# EasyEDA schematic SCH_test2_2024-01-14.json
TITLE: Sheet_1; REV: 1.0; Date: 2024-01-11; Sheet: 1/1; Drawn By: Dominic Cangemi; Company: Your Company
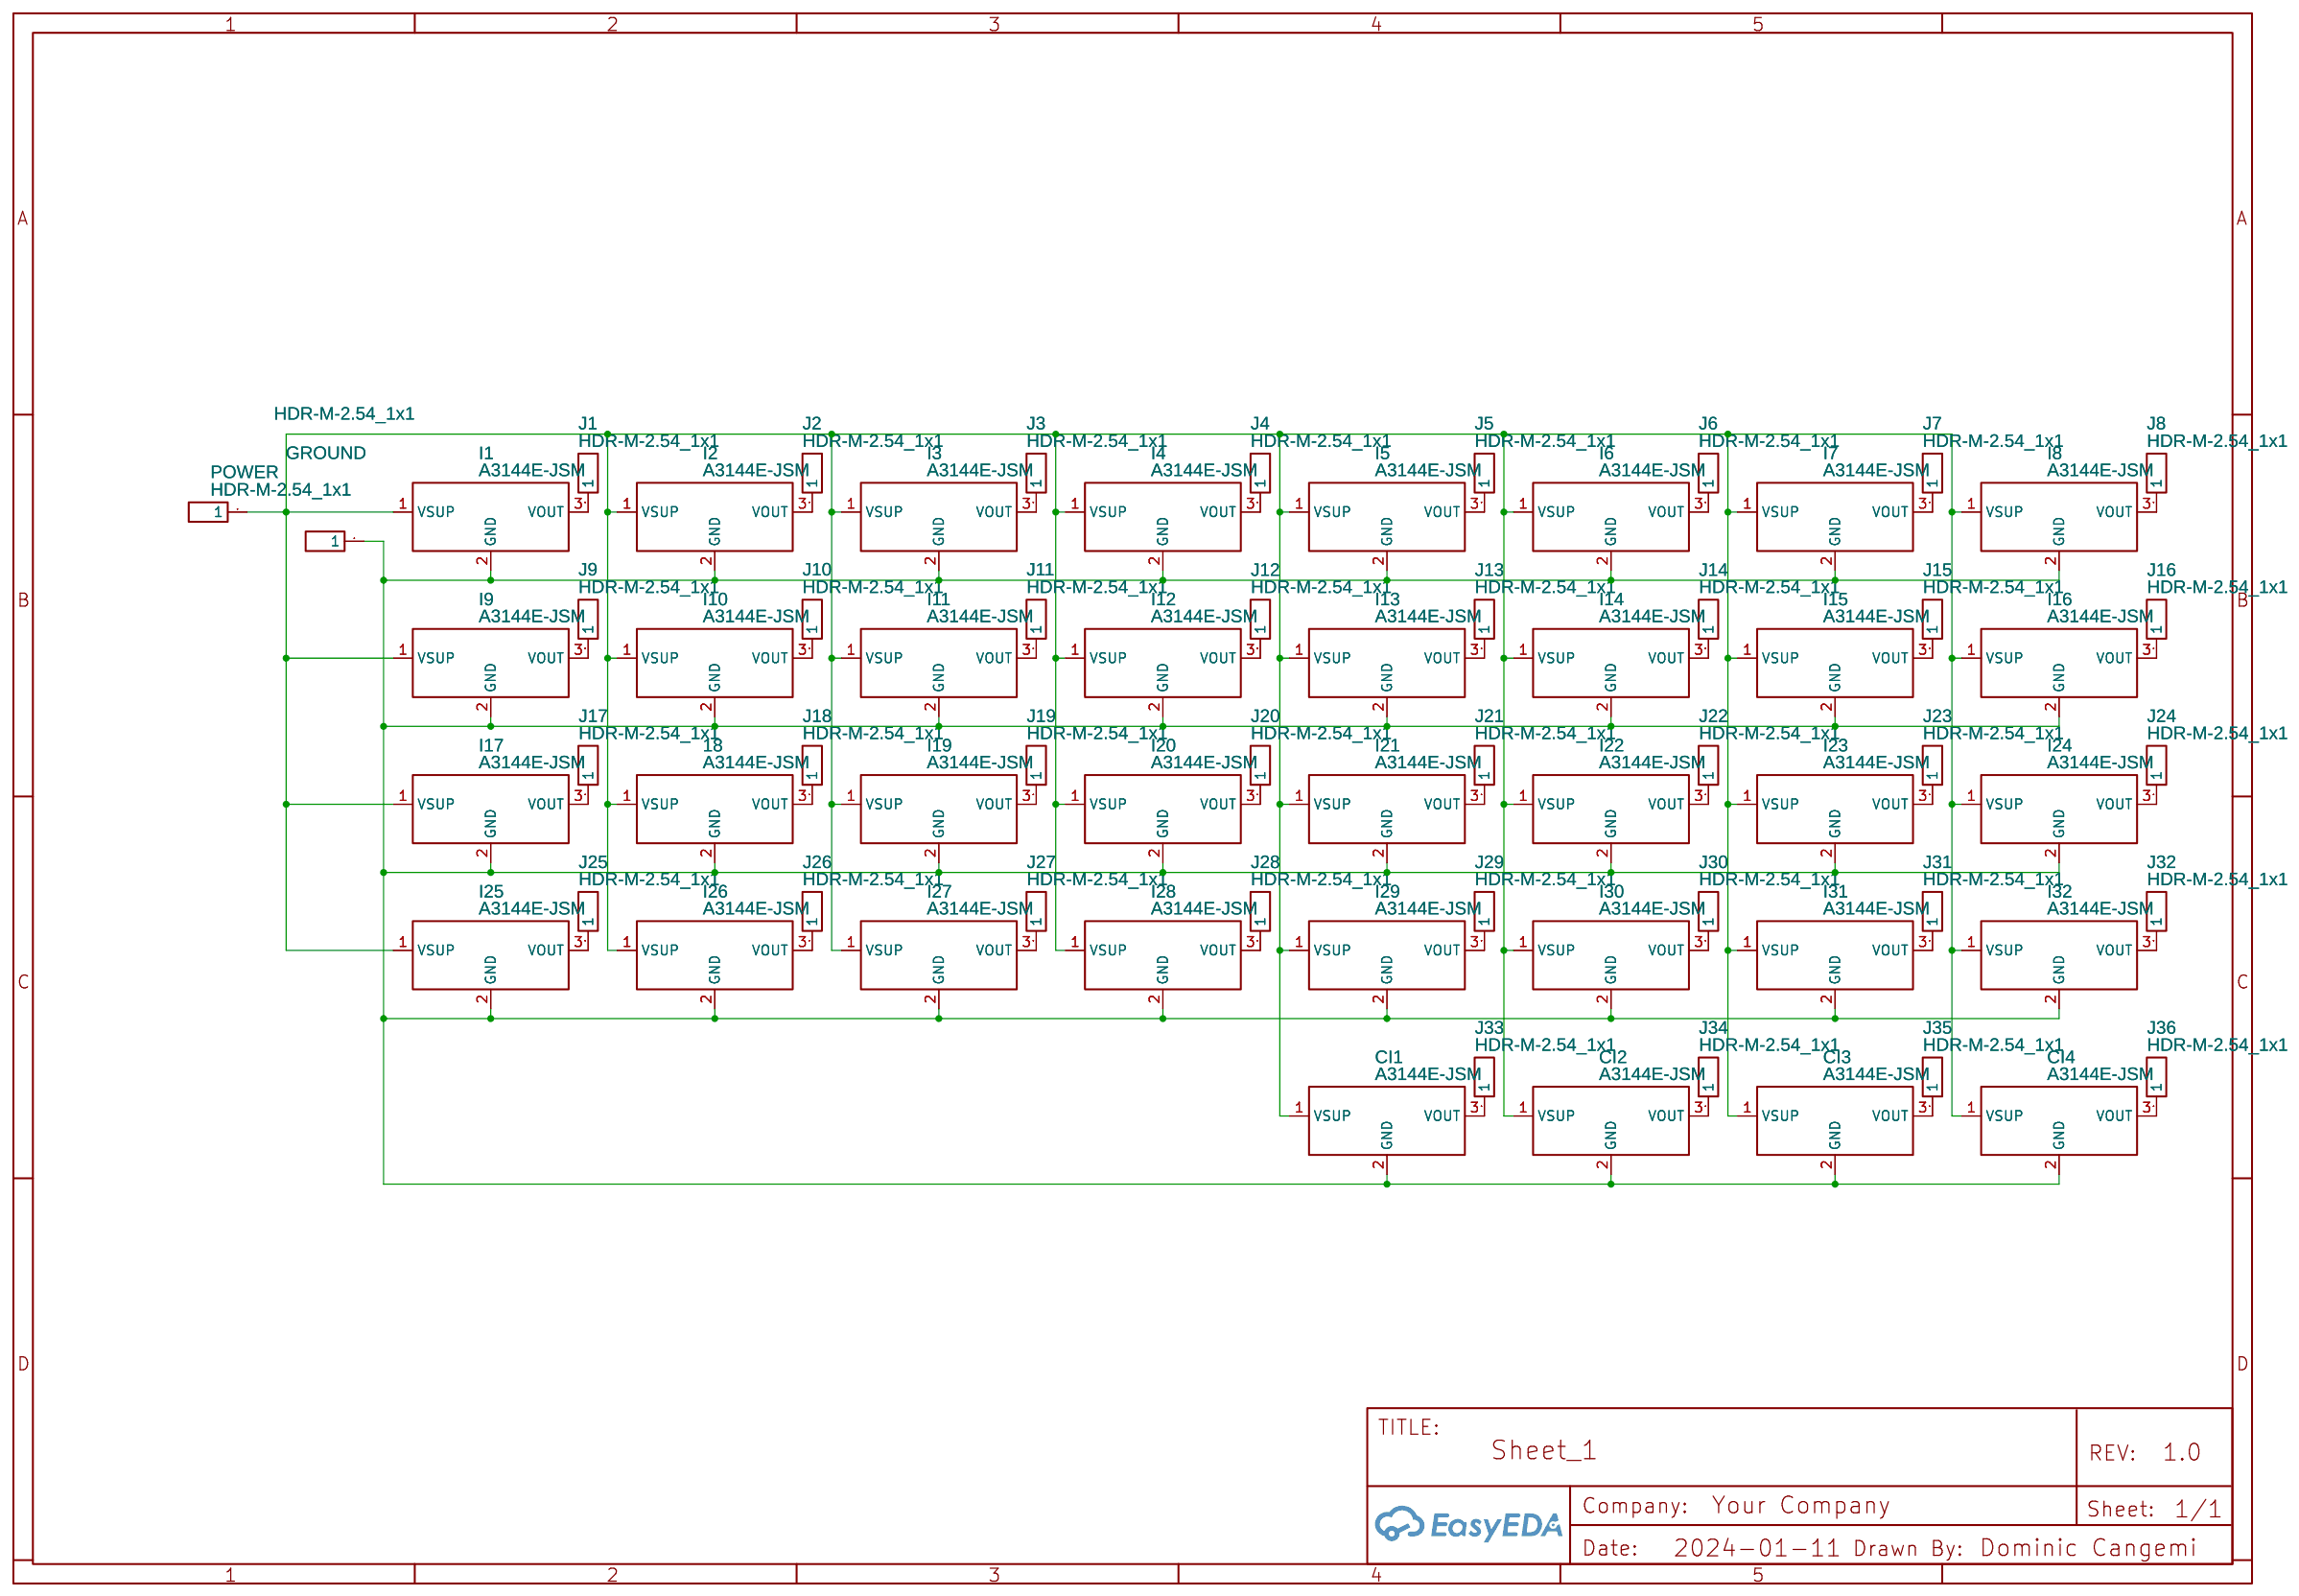
[diagram p0: schematic sheet]

## Parts
18  A3144E-JSM  [SOT-23-3_L2.9-W1.6-P1.90-LS2.8-BR-CW]
CI1  A3144E-JSM  [SOT-23-3_L2.9-W1.6-P1.90-LS2.8-BR-CW]
CI2  A3144E-JSM  [SOT-23-3_L2.9-W1.6-P1.90-LS2.8-BR-CW]
CI3  A3144E-JSM  [SOT-23-3_L2.9-W1.6-P1.90-LS2.8-BR-CW]
CI4  A3144E-JSM  [SOT-23-3_L2.9-W1.6-P1.90-LS2.8-BR-CW]
GROUND  HDR-M-2.54_1x1  [HDR-M-2.54_1X1]
I1  A3144E-JSM  [SOT-23-3_L2.9-W1.6-P1.90-LS2.8-BR-CW]
I2  A3144E-JSM  [SOT-23-3_L2.9-W1.6-P1.90-LS2.8-BR-CW]
I3  A3144E-JSM  [SOT-23-3_L2.9-W1.6-P1.90-LS2.8-BR-CW]
I4  A3144E-JSM  [SOT-23-3_L2.9-W1.6-P1.90-LS2.8-BR-CW]
I5  A3144E-JSM  [SOT-23-3_L2.9-W1.6-P1.90-LS2.8-BR-CW]
I6  A3144E-JSM  [SOT-23-3_L2.9-W1.6-P1.90-LS2.8-BR-CW]
I7  A3144E-JSM  [SOT-23-3_L2.9-W1.6-P1.90-LS2.8-BR-CW]
I8  A3144E-JSM  [SOT-23-3_L2.9-W1.6-P1.90-LS2.8-BR-CW]
I9  A3144E-JSM  [SOT-23-3_L2.9-W1.6-P1.90-LS2.8-BR-CW]
I10  A3144E-JSM  [SOT-23-3_L2.9-W1.6-P1.90-LS2.8-BR-CW]
I11  A3144E-JSM  [SOT-23-3_L2.9-W1.6-P1.90-LS2.8-BR-CW]
I12  A3144E-JSM  [SOT-23-3_L2.9-W1.6-P1.90-LS2.8-BR-CW]
I13  A3144E-JSM  [SOT-23-3_L2.9-W1.6-P1.90-LS2.8-BR-CW]
I14  A3144E-JSM  [SOT-23-3_L2.9-W1.6-P1.90-LS2.8-BR-CW]
I15  A3144E-JSM  [SOT-23-3_L2.9-W1.6-P1.90-LS2.8-BR-CW]
I16  A3144E-JSM  [SOT-23-3_L2.9-W1.6-P1.90-LS2.8-BR-CW]
I17  A3144E-JSM  [SOT-23-3_L2.9-W1.6-P1.90-LS2.8-BR-CW]
I19  A3144E-JSM  [SOT-23-3_L2.9-W1.6-P1.90-LS2.8-BR-CW]
I20  A3144E-JSM  [SOT-23-3_L2.9-W1.6-P1.90-LS2.8-BR-CW]
I21  A3144E-JSM  [SOT-23-3_L2.9-W1.6-P1.90-LS2.8-BR-CW]
I22  A3144E-JSM  [SOT-23-3_L2.9-W1.6-P1.90-LS2.8-BR-CW]
I23  A3144E-JSM  [SOT-23-3_L2.9-W1.6-P1.90-LS2.8-BR-CW]
I24  A3144E-JSM  [SOT-23-3_L2.9-W1.6-P1.90-LS2.8-BR-CW]
I25  A3144E-JSM  [SOT-23-3_L2.9-W1.6-P1.90-LS2.8-BR-CW]
I26  A3144E-JSM  [SOT-23-3_L2.9-W1.6-P1.90-LS2.8-BR-CW]
I27  A3144E-JSM  [SOT-23-3_L2.9-W1.6-P1.90-LS2.8-BR-CW]
I28  A3144E-JSM  [SOT-23-3_L2.9-W1.6-P1.90-LS2.8-BR-CW]
I29  A3144E-JSM  [SOT-23-3_L2.9-W1.6-P1.90-LS2.8-BR-CW]
I30  A3144E-JSM  [SOT-23-3_L2.9-W1.6-P1.90-LS2.8-BR-CW]
I31  A3144E-JSM  [SOT-23-3_L2.9-W1.6-P1.90-LS2.8-BR-CW]
I32  A3144E-JSM  [SOT-23-3_L2.9-W1.6-P1.90-LS2.8-BR-CW]
J1  HDR-M-2.54_1x1  [HDR-M-2.54_1X1]
J2  HDR-M-2.54_1x1  [HDR-M-2.54_1X1]
J3  HDR-M-2.54_1x1  [HDR-M-2.54_1X1]
J4  HDR-M-2.54_1x1  [HDR-M-2.54_1X1]
J5  HDR-M-2.54_1x1  [HDR-M-2.54_1X1]
J6  HDR-M-2.54_1x1  [HDR-M-2.54_1X1]
J7  HDR-M-2.54_1x1  [HDR-M-2.54_1X1]
J8  HDR-M-2.54_1x1  [HDR-M-2.54_1X1]
J9  HDR-M-2.54_1x1  [HDR-M-2.54_1X1]
J10  HDR-M-2.54_1x1  [HDR-M-2.54_1X1]
J11  HDR-M-2.54_1x1  [HDR-M-2.54_1X1]
J12  HDR-M-2.54_1x1  [HDR-M-2.54_1X1]
J13  HDR-M-2.54_1x1  [HDR-M-2.54_1X1]
J14  HDR-M-2.54_1x1  [HDR-M-2.54_1X1]
J15  HDR-M-2.54_1x1  [HDR-M-2.54_1X1]
J16  HDR-M-2.54_1x1  [HDR-M-2.54_1X1]
J17  HDR-M-2.54_1x1  [HDR-M-2.54_1X1]
J18  HDR-M-2.54_1x1  [HDR-M-2.54_1X1]
J19  HDR-M-2.54_1x1  [HDR-M-2.54_1X1]
J20  HDR-M-2.54_1x1  [HDR-M-2.54_1X1]
J21  HDR-M-2.54_1x1  [HDR-M-2.54_1X1]
J22  HDR-M-2.54_1x1  [HDR-M-2.54_1X1]
J23  HDR-M-2.54_1x1  [HDR-M-2.54_1X1]
J24  HDR-M-2.54_1x1  [HDR-M-2.54_1X1]
J25  HDR-M-2.54_1x1  [HDR-M-2.54_1X1]
J26  HDR-M-2.54_1x1  [HDR-M-2.54_1X1]
J27  HDR-M-2.54_1x1  [HDR-M-2.54_1X1]
J28  HDR-M-2.54_1x1  [HDR-M-2.54_1X1]
J29  HDR-M-2.54_1x1  [HDR-M-2.54_1X1]
J30  HDR-M-2.54_1x1  [HDR-M-2.54_1X1]
J31  HDR-M-2.54_1x1  [HDR-M-2.54_1X1]
J32  HDR-M-2.54_1x1  [HDR-M-2.54_1X1]
J33  HDR-M-2.54_1x1  [HDR-M-2.54_1X1]
J34  HDR-M-2.54_1x1  [HDR-M-2.54_1X1]
J35  HDR-M-2.54_1x1  [HDR-M-2.54_1X1]
J36  HDR-M-2.54_1x1  [HDR-M-2.54_1X1]
POWER  HDR-M-2.54_1x1  [HDR-M-2.54_1X1]

## Library data of the parts
18 CI1-CI4 I1-I17 I19-I32 = A3144E-JSM: Supplier: LCSC; Supplier Part: C18221462; Manufacturer: JSMSEMI(杰盛微); Contributor: lcsc
GROUND J1-J36 POWER = HDR-M-2.54_1x1: Supplier Part: C81276; Supplier: LCSC; Contributor: LCEDA_Lib

## Nets
Net-(18-1): 18.1(VSUP) CI1.1(VSUP) CI2.1(VSUP) CI3.1(VSUP) CI4.1(VSUP) I1.1(VSUP) I2.1(VSUP) I3.1(VSUP) I4.1(VSUP) I5.1(VSUP) I6.1(VSUP) I7.1(VSUP) I8.1(VSUP) I9.1(VSUP) I10.1(VSUP) I11.1(VSUP) I12.1(VSUP) I13.1(VSUP) I14.1(VSUP) I15.1(VSUP) I16.1(VSUP) I17.1(VSUP) I19.1(VSUP) I20.1(VSUP) I21.1(VSUP) I22.1(VSUP) I23.1(VSUP) I24.1(VSUP) I25.1(VSUP) I26.1(VSUP) I27.1(VSUP) I28.1(VSUP) I29.1(VSUP) I30.1(VSUP) I31.1(VSUP) I32.1(VSUP) POWER.1
Net-(18-2): 18.2(GND) CI1.2(GND) CI2.2(GND) CI3.2(GND) CI4.2(GND) GROUND.1 I1.2(GND) I2.2(GND) I3.2(GND) I4.2(GND) I5.2(GND) I6.2(GND) I7.2(GND) I8.2(GND) I9.2(GND) I10.2(GND) I11.2(GND) I12.2(GND) I13.2(GND) I14.2(GND) I15.2(GND) I16.2(GND) I17.2(GND) I19.2(GND) I20.2(GND) I21.2(GND) I22.2(GND) I23.2(GND) I24.2(GND) I25.2(GND) I26.2(GND) I27.2(GND) I28.2(GND) I29.2(GND) I30.2(GND) I31.2(GND) I32.2(GND)
Net-(18-3): 18.3(VOUT) J18.1
Net-(CI1-3): CI1.3(VOUT) J33.1
Net-(CI2-3): CI2.3(VOUT) J34.1
Net-(CI3-3): CI3.3(VOUT) J35.1
Net-(CI4-3): CI4.3(VOUT) J36.1
Net-(I1-3): I1.3(VOUT) J1.1
Net-(I2-3): I2.3(VOUT) J2.1
Net-(I3-3): I3.3(VOUT) J3.1
Net-(I4-3): I4.3(VOUT) J4.1
Net-(I5-3): I5.3(VOUT) J5.1
Net-(I6-3): I6.3(VOUT) J6.1
Net-(I7-3): I7.3(VOUT) J7.1
Net-(I8-3): I8.3(VOUT) J8.1
Net-(I9-3): I9.3(VOUT) J9.1
Net-(I10-3): I10.3(VOUT) J10.1
Net-(I11-3): I11.3(VOUT) J11.1
Net-(I12-3): I12.3(VOUT) J12.1
Net-(I13-3): I13.3(VOUT) J13.1
Net-(I14-3): I14.3(VOUT) J14.1
Net-(I15-3): I15.3(VOUT) J15.1
Net-(I16-3): I16.3(VOUT) J16.1
Net-(I17-3): I17.3(VOUT) J17.1
Net-(I19-3): I19.3(VOUT) J19.1
Net-(I20-3): I20.3(VOUT) J20.1
Net-(I21-3): I21.3(VOUT) J21.1
Net-(I22-3): I22.3(VOUT) J22.1
Net-(I23-3): I23.3(VOUT) J23.1
Net-(I24-3): I24.3(VOUT) J24.1
Net-(I25-3): I25.3(VOUT) J25.1
Net-(I26-3): I26.3(VOUT) J26.1
Net-(I27-3): I27.3(VOUT) J27.1
Net-(I28-3): I28.3(VOUT) J28.1
Net-(I29-3): I29.3(VOUT) J29.1
Net-(I30-3): I30.3(VOUT) J30.1
Net-(I31-3): I31.3(VOUT) J31.1
Net-(I32-3): I32.3(VOUT) J32.1
